# Altium project sense_logic.PrjPcb
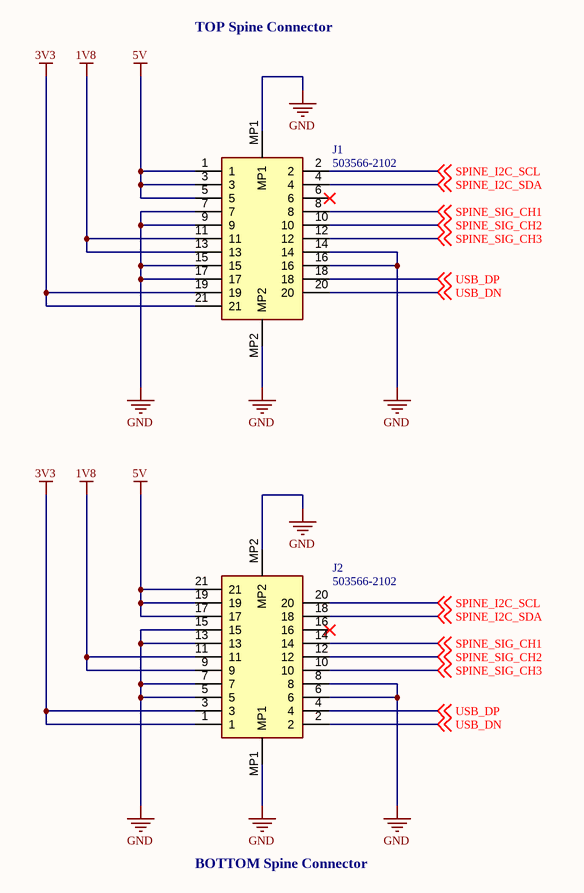
[diagram p0: SPINE_CONNECTOR.SchDoc]
5 sheets, 27 parts. Net scope: global (net labels, ports and power ports of the same name join across sheets).
Board file: sense_logic.PcbDoc
Sheets:
  SPINE_CONNECTOR.SchDoc
  AUX_CONNECTOR.SchDoc
  USB_CONNECTOR.SchDoc
  LOGIC_CONNECTOR.SchDoc
  LOGIC.SchDoc

## Sheet SPINE_CONNECTOR.SchDoc
size Letter; SheetNumber: 1; SheetTotal: 5

### Parts
J1  503566-2102  [5035662102]
J2  503566-2102  [5035662102]

### Nets
1V8: J1.11 J1.13 J2.9 J2.11
3V3: J1.19 J1.21 J2.1 J2.3
5V: J1.1 J1.3 J1.5 J2.17 J2.19 J2.21
GND: J1.7 J1.9 J1.14 J1.15 J1.16 J1.17 J1.MP1 J1.MP2 J2.5 J2.6 J2.7 J2.8 J2.13 J2.15 J2.MP1 J2.MP2
SPINE_I2C_SCL: J1.2 J2.20 ; off-sheet SPINE_I2C_SCL
SPINE_I2C_SDA: J1.4 J2.18 ; off-sheet SPINE_I2C_SDA
SPINE_SIG_CH1: J1.8 J2.14 ; off-sheet SPINE_SIG_CH1
SPINE_SIG_CH2: J1.10 J2.12 ; off-sheet SPINE_SIG_CH2
SPINE_SIG_CH3: J1.12 J2.10 ; off-sheet SPINE_SIG_CH3
USB_DN: J1.20 J2.2 ; off-sheet USB_DN
USB_DP: J1.18 J2.4 ; off-sheet USB_DP

Not connected (* = marked no-connect by the designer): J1 6*; J2 16*

### Notes on the sheet
- TOP Spine Connector
- BOTTOM Spine Connector
- Title
- Copyright (c) Meta Platforms, Inc. and affiliates.
  All rights reserved.
  This source code is licensed under the license found in the
  LICENSE file in the root directory of this source tree.
- Sheet
- of

### Library data of the parts
J1 J2 = 503566-2102: Connector; Manufacturer_Name: Molex; Datasheet Link: https://www.molex.com/pdm_docs/sd/5035662102_sd.pdf; Height: 1.69mm; Manufacturer_Part_Number: 503566-2102; Mouser Part Number: 538-503566-2102; Mouser Price/Stock: https://www.mouser.co.uk/ProductDetail/Molex/503566-2102?qs=0lSvoLzn4L8%252Bw2FHrppS3g%3D%3D

## Sheet AUX_CONNECTOR.SchDoc
size Letter; SheetNumber: 2; SheetTotal: 5
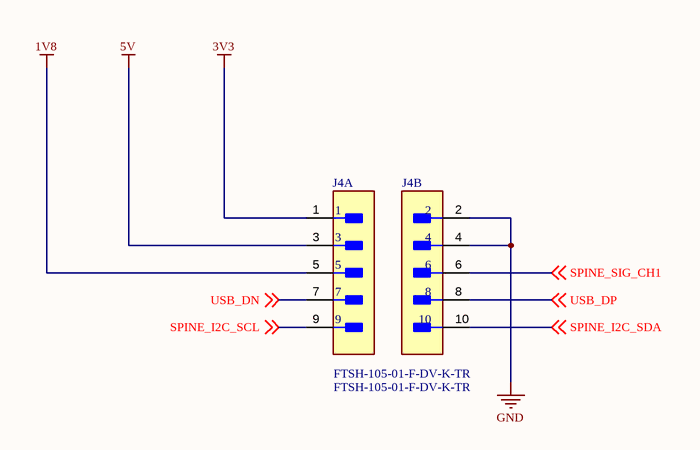
[diagram p1: AUX_CONNECTOR.SchDoc]

### Parts
J4  FTSH-105-01-F-DV-K-TR  [FP-FTSH-105-01-F-DV-K-TR-MFG]  (parts A,B of 2)

### Nets
1V8: J4.5
3V3: J4.1
5V: J4.3
GND: J4.2 J4.4
SPINE_I2C_SCL: J4.9 ; off-sheet SPINE_I2C_SCL
SPINE_I2C_SDA: J4.10 ; off-sheet SPINE_I2C_SDA
SPINE_SIG_CH1: J4.6 ; off-sheet SPINE_SIG_CH1
USB_DN: J4.7 ; off-sheet USB_DN
USB_DP: J4.8 ; off-sheet USB_DP

### Notes on the sheet
- Title
- Copyright (c) Meta Platforms, Inc. and affiliates.
  All rights reserved.
  This source code is licensed under the license found in the
  LICENSE file in the root directory of this source tree.
- Sheet
- of

### Library data of the parts
J4 = CMP-02766-000004-2: CONN HEADER SMD 10POS 1.27MM; Number of Contacts: 10; Max Current Rating: 1.75A; Max Operating Temperature: 125°C; Number of Rows: 2; Pitch: 1.27mm; Contact Plating: Gold; Length: 6.35mm; Min Operating Temperature: -55°C; Packaging: Tape and Reel; Orientation: Straight; Contact Material: Bronze; Depth: 3.43mm; Housing Color: Black; Housing Material: Polymer; Radiation Hardening: No; Termination: Solder; Lead Free: Lead Free

## Sheet USB_CONNECTOR.SchDoc
size Letter; SheetNumber: 3; SheetTotal: 5
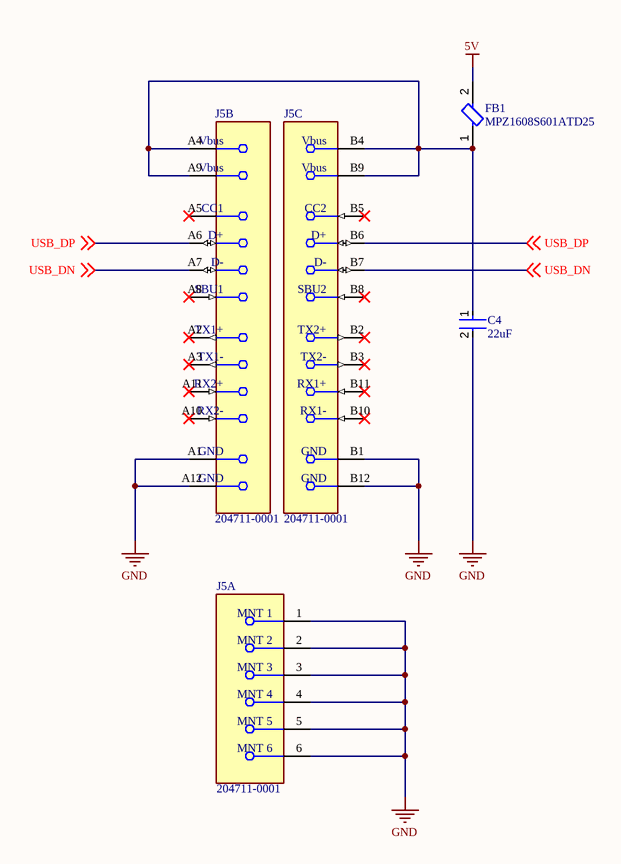
[diagram p2: USB_CONNECTOR.SchDoc]

### Parts
C4  22uF  [FP-CL10-IPC_B]
FB1  MPZ1608S601ATD25  [FP-MPZ1608-0_8-IPC_B]
J5  204711-0001  [FP-204711-0001-MFG]  (parts A,B,C of 3)

### Nets
5V: FB1.2
GND: C4.2 J5.1(MNT_1) J5.2(MNT_2) J5.3(MNT_3) J5.4(MNT_4) J5.5(MNT_5) J5.6(MNT_6) J5.A1(GND) J5.A12(GND) J5.B1(GND) J5.B12(GND)
USB_DN: J5.A7(D-) J5.B7(D-) ; off-sheet USB_DN
USB_DP: J5.A6(D+) J5.B6(D+) ; off-sheet USB_DP
NetC4_1: C4.1 FB1.1 J5.A4(Vbus) J5.A9(Vbus) J5.B4(Vbus) J5.B9(Vbus)

Not connected (* = marked no-connect by the designer): J5 A2(TX1+)* A3(TX1-)* A5(CC1)* A8(SBU1)* A10(RX2-)* A11(RX2+)* B2(TX2+)* B3(TX2-)* B5(CC2)* B8(SBU2)* B10(RX1-)* B11(RX1+)*

### Notes on the sheet
- Title
- Copyright (c) Meta Platforms, Inc. and affiliates.
  All rights reserved.
  This source code is licensed under the license found in the
  LICENSE file in the root directory of this source tree.
- Sheet
- of

### Library data of the parts
C4 = CMP-13271-003290-1: Cap Ceramic 22uF 10V X5R ±20% Pad SMD 0603 +85°C T/R; Max Operating Temperature: 85°C; Packaging: Tape and Reel; Mount: Surface Mount; Width: 0.031inch; Length: 0.063inch; Min Operating Temperature: -55°C; Voltage Rating: 10V; Case/Package: 0603; Thickness: 0.037inch; Case Code (Metric): 1608; Tolerance: 20%; Case Code (Imperial): 0603; Capacitance: 22uF
FB1 = CMP-08257-000403-1: Power line Ferrite Bead 600Ω @ 100MHz 1A DCR 0.15Ω AEC-Q200 SMD 0603; Number of Lines: 1; DC Resistance (DCR): 150mR; Impedance: 600R; Tolerance: 25%; Length: 0.063inch; Max Operating Temperature: 125°C; Lead Free: Lead Free; Min Operating Temperature: -55°C; Test Frequency: 100MHz; Termination: SMD/SMT; Packaging: Tape and Reel; Package Quantity: 4000; Case Code (Metric): 1608; Series: MPZ; Max Current Rating: 1A; Mount: Surface Mount; Max DC Current: 1A; RoHS Compliant: Yes; Case/Package: 0603; Weight: 7.1E-05oz; Ratings: AEC-Q200; Height: 0.037inch; Width: 0.031inch; Case Code (Imperial): 0603
J5 = CMP-04767-000011-1: USB VERTICAL TYPE C 3.1

## Sheet LOGIC_CONNECTOR.SchDoc
size Letter; SheetNumber: 4; SheetTotal: 5
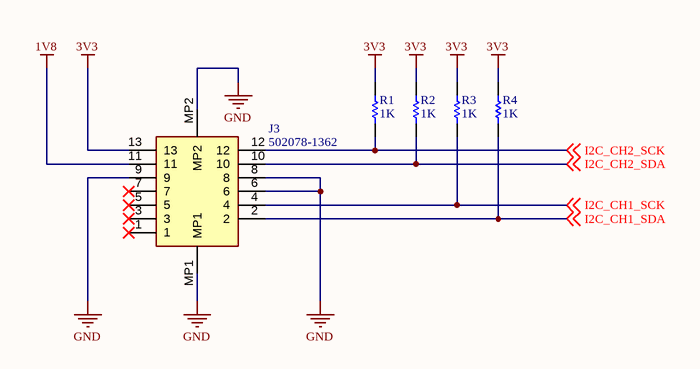
[diagram p3: LOGIC_CONNECTOR.SchDoc]

### Parts
J3  502078-1362  [5020781362]
R1  1K  [RESC1005X40X25LL05T10]
R2  1K  [RESC1005X40X25LL05T10]
R3  1K  [RESC1005X40X25LL05T10]
R4  1K  [RESC1005X40X25LL05T10]

### Nets
1V8: J3.11
3V3: J3.13 R1.2 R2.2 R3.2 R4.2
GND: J3.6 J3.8 J3.9 J3.MP1 J3.MP2
I2C_CH1_SCK: J3.4 R3.1 ; off-sheet I2C_CH1_SCK
I2C_CH1_SDA: J3.2 R4.1 ; off-sheet I2C_CH1_SDA
I2C_CH2_SCK: J3.12 R1.1 ; off-sheet I2C_CH2_SCK
I2C_CH2_SDA: J3.10 R2.1 ; off-sheet I2C_CH2_SDA

Not connected (* = marked no-connect by the designer): J3 1* 3* 5* 7*

### Notes on the sheet
- Title
- Copyright (c) Meta Platforms, Inc. and affiliates.
  All rights reserved.
  This source code is licensed under the license found in the
  LICENSE file in the root directory of this source tree.
- Sheet
- of

### Library data of the parts
J3 = 502078-1362: Connector; Manufacturer_Name: Molex; Datasheet Link: https://www.molex.com/pdm_docs/sd/5020781362_sd.pdf; Height: 1.7mm; Manufacturer_Part_Number: 502078-1362; Mouser Part Number: 538-502078-1362; Mouser Price/Stock: https://www.mouser.co.uk/ProductDetail/Molex/502078-1362?qs=GBLSl2Akirt8csfPYHMErA%3D%3D
R1-R4 = CMP-2002-07941-1: Part Number: RC0402JR-071KL; Manufacturer: Yageo / Phycomp

## Sheet LOGIC.SchDoc
size Letter; SheetNumber: 5; SheetTotal: 5
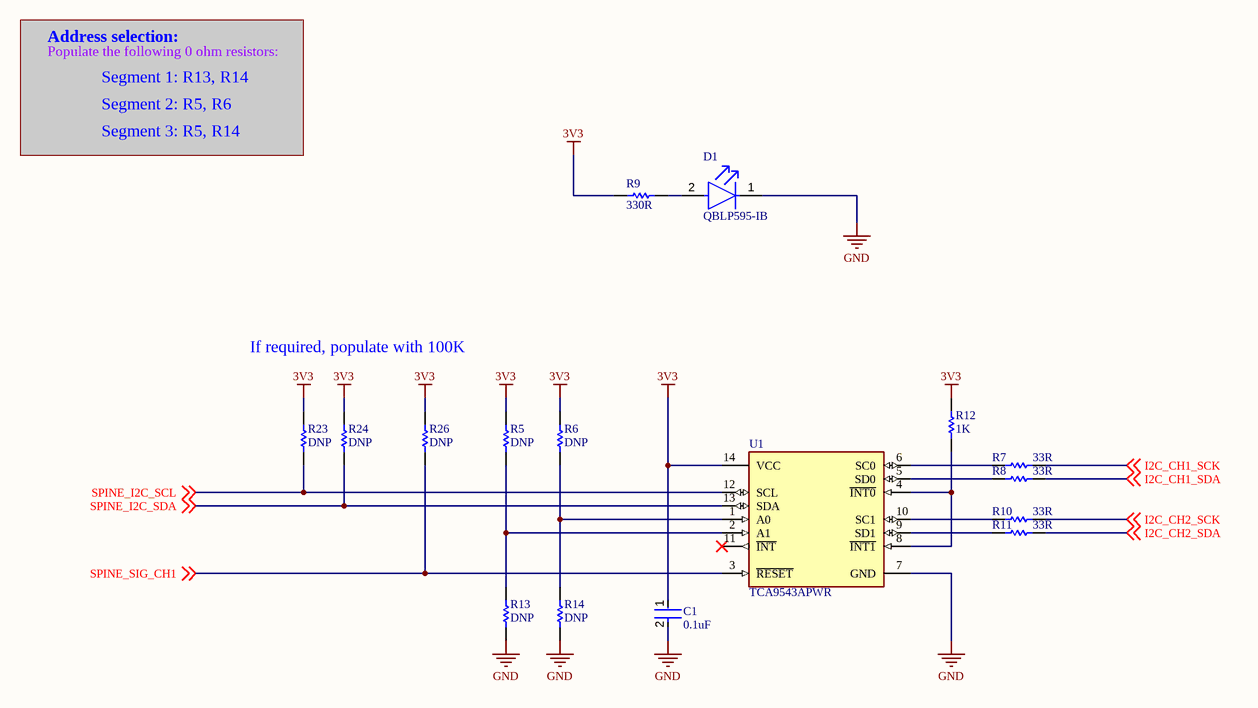
[diagram p4: LOGIC.SchDoc]

### Parts
C1  0.1uF  [FP-GRM15-MFG]
D1  QBLP595-IB  [FP-QBLP595-IB-MFG]
R5  DNP  [RESC1005X40X25NL05T10]
R6  DNP  [RESC1005X40X25NL05T10]
R7  33R  [RESC1005X40X25LL05T05]
R8  33R  [RESC1005X40X25LL05T05]
R9  330R  [RESC1005X40X25NL05T10]
R10  33R  [RESC1005X40X25LL05T05]
R11  33R  [RESC1005X40X25LL05T05]
R12  1K  [RESC1005X40X25LL05T10]
R13  DNP  [RESC1005X40X25NL05T10]
R14  DNP  [RESC1005X40X25NL05T10]
R23  DNP  [RESC1005X40X25ML10T10]
R24  DNP  [RESC1005X40X25ML10T10]
R26  DNP  [RESC1005X40X25ML10T10]
U1  TCA9543APWR  [FP-PW0014A-IPC_A]

### Nets
3V3: C1.1 R5.2 R6.2 R9.1 R12.2 R23.2 R24.2 R26.2 U1.14(VCC)
GND: C1.2 D1.1(C) R13.1 R14.1 U1.7(GND)
I2C_CH1_SCK: R7.2 ; off-sheet I2C_CH1_SCK
I2C_CH1_SDA: R8.2 ; off-sheet I2C_CH1_SDA
I2C_CH2_SCK: R10.2 ; off-sheet I2C_CH2_SCK
I2C_CH2_SDA: R11.2 ; off-sheet I2C_CH2_SDA
SPINE_I2C_SCL: R23.1 U1.12(SCL) ; off-sheet SPINE_I2C_SCL
SPINE_I2C_SDA: R24.1 U1.13(SDA) ; off-sheet SPINE_I2C_SDA
SPINE_SIG_CH1: R26.1 U1.3(~{RESET}) ; off-sheet SPINE_SIG_CH1
NetD1_2: D1.2(A) R9.2
NetR5_1: R5.1 R13.2 U1.2(A1)
NetR6_1: R6.1 R14.2 U1.1(A0)
NetR7_1: R7.1 U1.6(SC0)
NetR8_1: R8.1 U1.5(SD0)
NetR10_1: R10.1 U1.10(SC1)
NetR11_1: R11.1 U1.9(SD1)
NetR12_1: R12.1 U1.4(~{INT0}) U1.8(~{INT1})

Not connected (* = marked no-connect by the designer): U1 11(~{INT})*

### Notes on the sheet
- Address selection:
- Populate the following 0 ohm resistors:
- Segment 1: R13, R14
- Segment 2: R5, R6
- Segment 3: R5, R14
- If required, populate with 100K
- Title
- Copyright (c) Meta Platforms, Inc. and affiliates.
  All rights reserved.
  This source code is licensed under the license found in the
  LICENSE file in the root directory of this source tree.
- Sheet
- of

### Library data of the parts
C1 = CMP-2100-03641-2: CAP CER 0.1UF 16V X7R 0402; Manufacturer Part Number: GRM155R71C104KA88D; Manufacturer: Murata; Standoff Height: 0mm; Tolerance: 10%; Voltage Rating: 16Vdc; Material: Ceramic; Capacitance: 0.10μF; Value: 0.10μF; RoHS: TRUE; Temperature Characteristic: X7R; Octopart: https://octopart.com/grm155r71c104ka88d-murata-196880; Digikey Description: CAP CER 0.1UF 16V X7R 0402; Device Class L3: Ceramic Capacitors; Height: 0.55mm; ComponentLink2Description: Datasheet; Temperature Range Low: -55°C; Ipc Land Pattern Name: CAPC10050X219; ComponentLink2URL: https://search.murata.co.jp/Ceramy/image/img/A01X/G101/ENG/GRM155R71H471KA01-01A.pdf; Device Class L1: Passive Components; Lead Free: yes; Category: Cap; Package: GRM15; Temperature: -55°C to +125°C; Device Class L2: Capacitors; Temperature Range High: +125°C; Mouser Description: 0402 0.1 uF 16V ±10 % Tolerance X7R SMT Multilayer Ceramic Capacitor
D1 = CMP-113271-000002-1: LED BLUE CLEAR 0402 SMD; Lens Size: 0.5mm; Dominant Wavelength: 465nm; Forward Voltage: 3.1V; Lens Color: Colorless; Luminous Intensity: 85mcd; Test Current: 20mA; Viewing Angle: 140°; Lens Style: Flat; Width: 0.5mm; Case Code (Metric): 1005; Lens Transparency: Clear; Color: Blue; Packaging: Tape and Reel; Case Code (Imperial): 0402; Mount: Surface Mount; Length: 1mm; Case/Package: 0402; Height: 0.6mm
R5 R6 R13 R14 = CMP-1011-00001-2: Manufacturer: Yageo / Phycomp; Part Number: RC0402JR-070RL
R7 R8 R10 R11 = CMP-2002-01146-1: Manufacturer: Panasonic; Part Number: ERJ2RKF33R0X
R9 = CMP-2002-07985-1: Part Number: RC0402JR-07330RL; Manufacturer: Yageo / Phycomp
R12 = CMP-2002-07941-1: as R1 on sheet LOGIC_CONNECTOR
R23 R24 R26 = CMP-2002-05837-1: Part Number: ERA-2AED104X; Manufacturer: Panasonic
U1 = CMP-04892-000047-1: IC BUS SWITCH 2 X 1:2 14TSSOP; Max Supply Voltage: 5.5V; Propagation Delay: 1ns; Independent Circuits: 1; Min Supply Voltage: 1.65V; On-State Resistance: 16R; Supply Type: Single; High Level Output Current: 10uA; Packaging: Tape and Reel; RoHS Compliant: Yes; Case/Package: TSSOP; Weight: 0.002018oz; Number of Pins: 14; Max Operating Temperature: 85°C; Mount: Surface Mount; Lead Free: Lead Free; Min Operating Temperature: -40°C; Package Quantity: 2000

## Nets that join several sheets
1V8: SPINE_CONNECTOR (J1.11 J1.13 J2.9 J2.11), AUX_CONNECTOR (J4.5), LOGIC_CONNECTOR (J3.11)
3V3: SPINE_CONNECTOR (J1.19 J1.21 J2.1 J2.3), AUX_CONNECTOR (J4.1), LOGIC_CONNECTOR (5 pins), LOGIC (9 pins)
5V: SPINE_CONNECTOR (6 pins), AUX_CONNECTOR (J4.3), USB_CONNECTOR (FB1.2)
GND: SPINE_CONNECTOR (16 pins), AUX_CONNECTOR (J4.2 J4.4), USB_CONNECTOR (11 pins), LOGIC_CONNECTOR (5 pins), LOGIC (5 pins)
I2C_CH1_SCK: LOGIC_CONNECTOR (J3.4 R3.1), LOGIC (R7.2)
I2C_CH1_SDA: LOGIC_CONNECTOR (J3.2 R4.1), LOGIC (R8.2)
I2C_CH2_SCK: LOGIC_CONNECTOR (J3.12 R1.1), LOGIC (R10.2)
I2C_CH2_SDA: LOGIC_CONNECTOR (J3.10 R2.1), LOGIC (R11.2)
SPINE_I2C_SCL: SPINE_CONNECTOR (J1.2 J2.20), AUX_CONNECTOR (J4.9), LOGIC (R23.1 U1.12)
SPINE_I2C_SDA: SPINE_CONNECTOR (J1.4 J2.18), AUX_CONNECTOR (J4.10), LOGIC (R24.1 U1.13)
SPINE_SIG_CH1: SPINE_CONNECTOR (J1.8 J2.14), AUX_CONNECTOR (J4.6), LOGIC (R26.1 U1.3)
USB_DN: SPINE_CONNECTOR (J1.20 J2.2), AUX_CONNECTOR (J4.7), USB_CONNECTOR (J5.A7 J5.B7)
USB_DP: SPINE_CONNECTOR (J1.18 J2.4), AUX_CONNECTOR (J4.8), USB_CONNECTOR (J5.A6 J5.B6)